# EAGLE schematic bikecontroller (EAGLE 9.5.2)
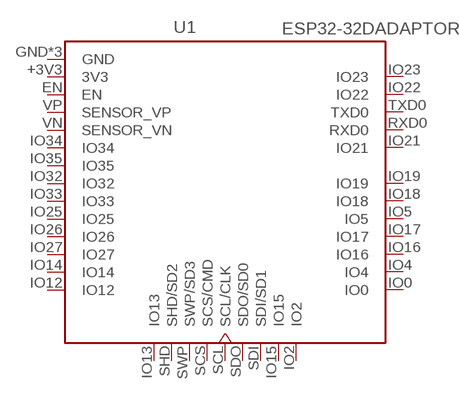
[diagram p0: schematic, sheet 1]

## Parts
U1  ESP32-32DADAPTOR  [ESP32_MODULE_ADAPTOR]
Unconnected: U1.EN U1.IO0 U1.IO2 U1.IO4 U1.IO5 U1.IO12 U1.IO13 U1.IO14 U1.IO15 U1.IO16 U1.IO17 U1.IO18 U1.IO19 U1.IO21 U1.IO22 U1.IO23 U1.IO25 U1.IO26 U1.IO27 U1.IO32 U1.IO33 U1.IO34 U1.IO35 U1.RXD0 U1.SCL(SCL/CLK) U1.SCS(SCS/CMD) U1.SDI(SDI/SD1) U1.SDO(SDO/SD0) U1.SHD(SHD/SD2) U1.SWP(SWP/SD3) U1.TXD0 U1.VN(SENSOR_VN) U1.VP(SENSOR_VP)

## Power pins joined to a net without a drawn wire
3V3: U1.+3V3(3V3)
GND: U1.GND U1.GND@1(GND) U1.GND@3(GND)

## Library data of the parts
U1 = CustomParts:ESP32-32D: IC: SoC; GPIO, I2C, I2S, IR, SD, SDIO, SPI, UART; 2.7÷3.6VDC; 20dBm